# EAGLE schematic schematic_V3.1 (EAGLE 9.6.1)
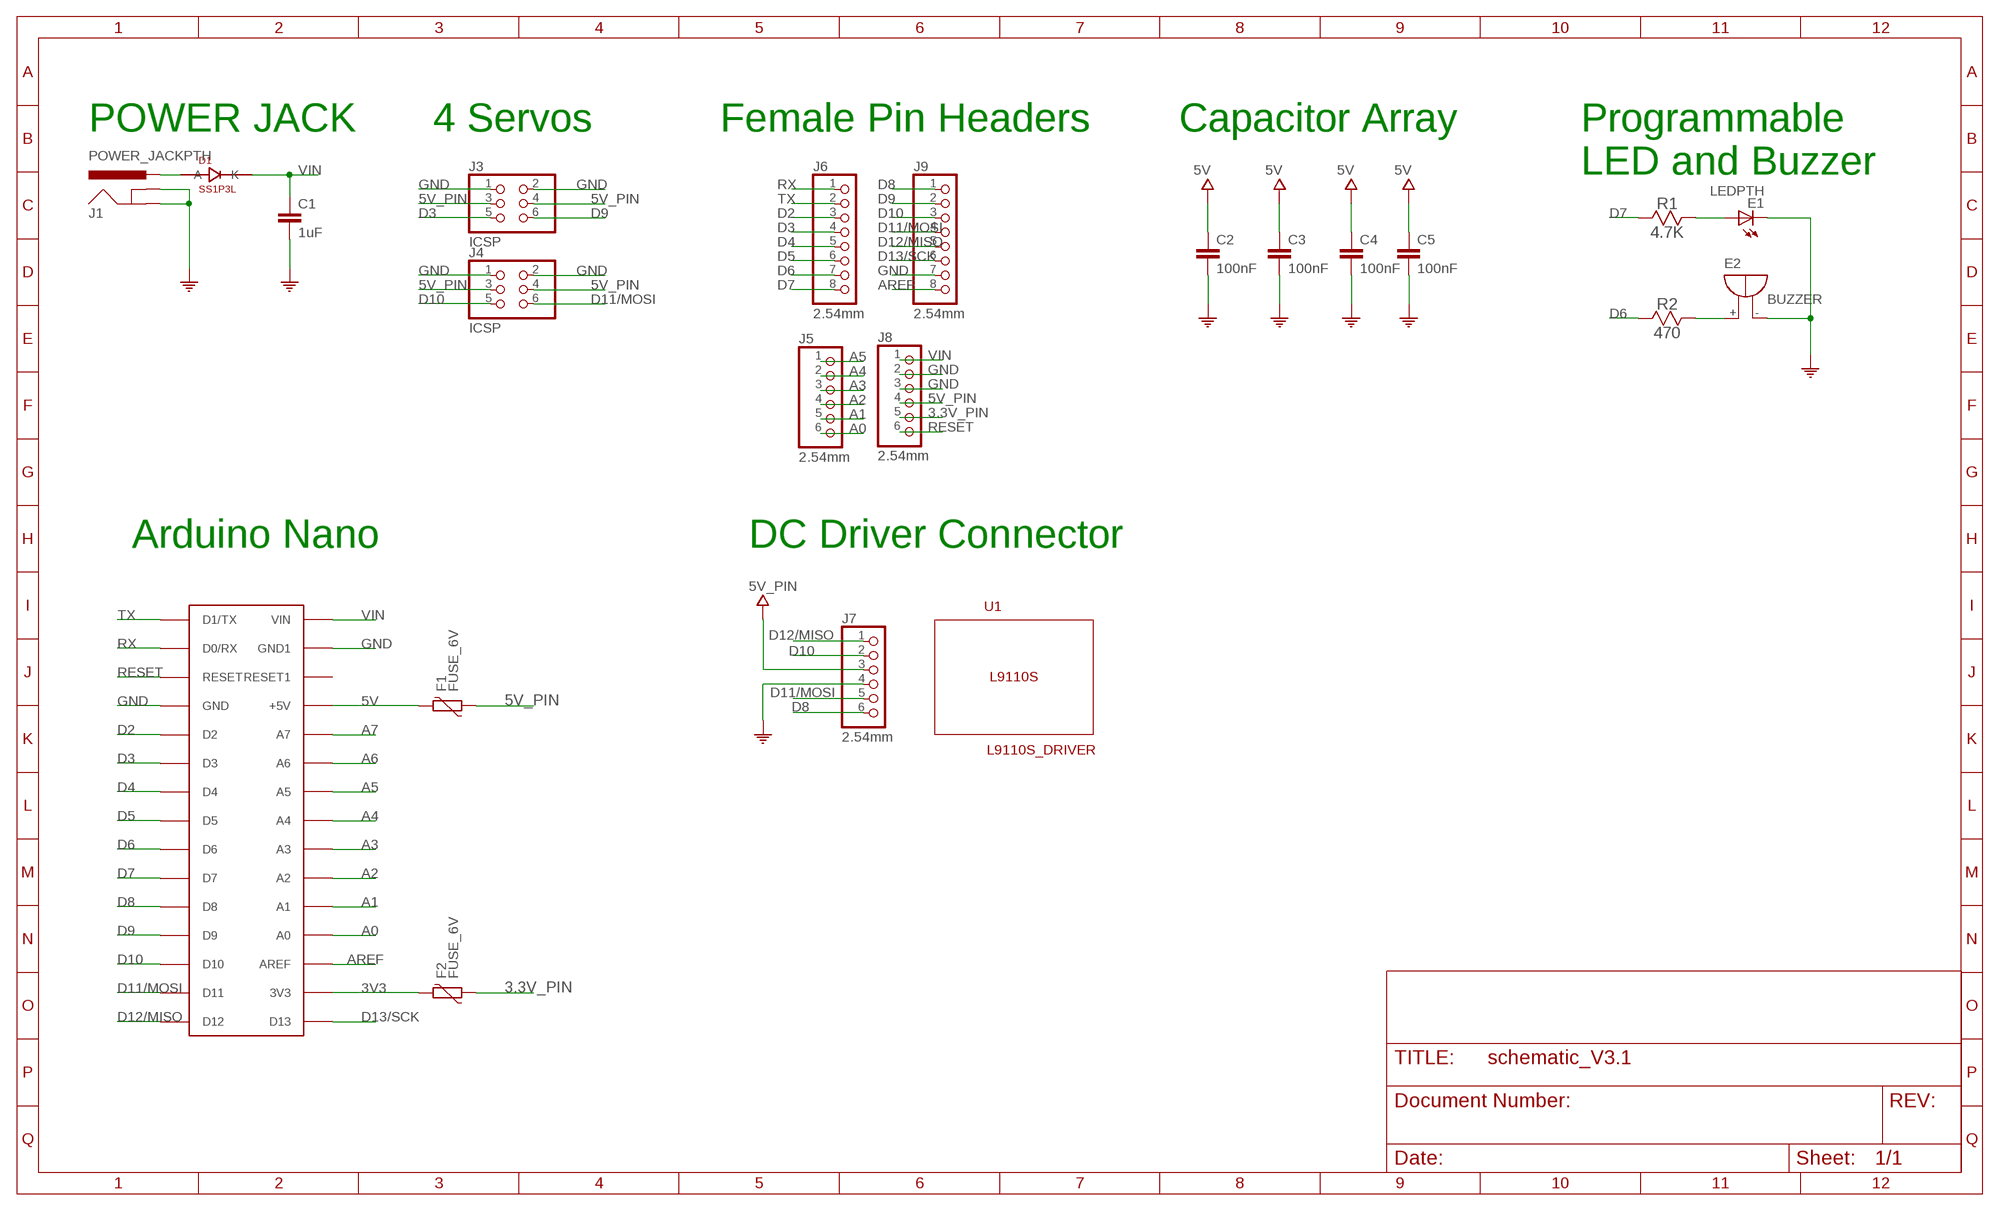
[diagram p0: schematic, sheet 1]

## Parts
C1  1uF  CAPACITOR_1UF_0603  [C0603-ROUND]
C2  100nF  CAPACITOR_100NF_0603  [C0603-ROUND]
C3  100nF  CAPACITOR_100NF_0603  [C0603-ROUND]
C4  100nF  CAPACITOR_100NF_0603  [C0603-ROUND]
C5  100nF  CAPACITOR_100NF_0603  [C0603-ROUND]
D1  SS1P3L  SCHOTTKY_DIODE  [DIODI_DO220AAL]
E1  LEDPTH  [LED5MM]
E2  BUZZER  [BUZZER]
F1  FUSE_6V  [FUSE_0603]
F2  FUSE_6V  [FUSE_0603]
J1  POWER_JACKPTH  [POWER_JACK_PTH]
J2  ARDUINONANO  [PDIP-32]
J3  ICSP  CONNECTOR_2X3  [CONNECTOR_2X3]
J4  ICSP  CONNECTOR_2X3  [CONNECTOR_2X3]
J5  2.54mm  PINHD-1X6  [1X06]
J6  2.54mm  PINHD-1X8  [1X08]
J7  2.54mm  PINHD-1X6  [1X06]
J8  2.54mm  PINHD-1X6  [1X06]
J9  2.54mm  PINHD-1X8  [1X08]
R1  4.7K  RESISTOR  [RESISTOR_PTH]
R2  470  RESISTOR  [RESISTOR_PTH]
U1  L9110S_DRIVER  [L9110S_DRIVER]

## Nets
3.3V_PIN: F2.1 J8.5
3V3: F2.2 J2.3V3
5V: C2.1 C3.1 C4.1 C5.1 F1.2 J2.+5V
5V_PIN: F1.1 J3.3 J3.4 J4.3 J4.4 J7.3 J8.4
A0: J2.A7(A0) J5.6
A1: J2.A6(A1) J5.5
A2: J2.A5(A2) J5.4
A3: J2.A4(A3) J5.3
A4: J2.A3(A4) J5.2
A5: J2.A2(A5) J5.1
A6: J2.A1(A6)
A7: J2.A0(A7)
AREF: J2.AREF J9.8
D2: J2.D2 J6.3
D3: J2.D3 J3.5 J6.4
D4: J2.D4 J6.5
D5: J2.D5 J6.6
D6: J2.D6 J6.7 R2.1
D7: J2.D7 J6.8 R1.1
D8: J2.D8 J7.6 J9.1
D9: J2.D9 J3.6 J9.2
D10: J2.D10 J4.5 J7.2 J9.3
D11/MOSI: J2.D11 J4.6 J7.5 J9.4
D12/MISO: J2.D12 J7.1 J9.5
D13/SCK: J2.D13 J9.6
GND: C1.2 C2.2 C3.2 C4.2 C5.2 E1.K(C) E2.- J1.GND J1.GNDBREAK J2.GND J2.GND1 J3.1 J3.2 J4.1 J4.2 J7.4 J8.2 J8.3 J9.7
N$16: D1.P$2(A) J1.PWR
N$18: E1.A R1.2
N$19: E2.+ R2.2
RESET: J2.RESET J8.6
RX: J2.D0/RX J6.1
TX: J2.D1/TX J6.2
VIN: C1.1 D1.P$1(K) J2.VIN J8.1
Unconnected: J2.RESET1

## Notes on the sheet
- POWER JACK | 4 Servos | Female Pin Headers | Capacitor Array
- Programmable 
  LED and Buzzer
- Arduino Nano | DC Driver Connector

## Library data of the parts
C1 = barnabas_noggin_V4:CAPACITOR_1UF_0603: 1uF 0603; PARTNO: CC0603KRX5R8BB105
C2-C5 = barnabas_noggin_V4:CAPACITOR_100NF_0603: CAP CER 0.1UF 50V Y5V 0603; PARTNO: CC0603ZRY5V9BB104
D1 = barnabas_noggin_V4:SCHOTTKY_DIODE: 1A 30V Schottky Barrier Rectifiers -SS1P3L-M3/84A; PARTNO: SS1P3L-M3/84A
E1 = barnabas_noggin_V4:LEDPTH
E2 = barnabas_noggin_V4:BUZZER: BUZZER Source: Buerklin; OC_FARNELL: unknown; OC_NEWARK: unknown
F1 F2 = barnabas_noggin_V4:FUSE_6V: SMD PTC
J1 = barnabas_noggin_V4:POWER_JACK: Power Jack This is the standard 5.5mm barrel jack for power. The PTH is the most common, proven, reliable, footprint. All others are experimental. The Slot footprint only works if the mill layer is transmitted to the PCB fab house so be warned. Spark Fun Electronics SKU : PRT-00119. Mating wall wart : TOL-00298 (and others); PARTNO: EJ508A
J2 = barnabas_noggin_V4:ARDUINONANO
J3 J4 = barnabas_noggin_V4:CONNECTOR_2X3: 3x2 M V h 8,5 mm p2,54; PARTNO: M20-9980346
J5 J7 J8 = barnabas_noggin_V4:PINHD-1X6: PIN HEADER; PARTNO: M20-7820646
J6 J9 = barnabas_noggin_V4:PINHD-1X8: PIN HEADER; PARTNO: PPTC081LFBN-RC
R1 R2 = barnabas_noggin_V4:RESISTOR
U1 = barnabas_noggin_V4:L9110S_DRIVER